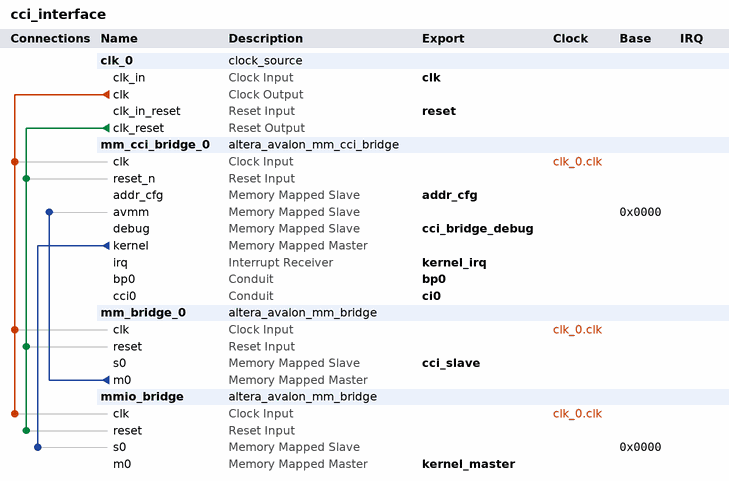
[diagram p0: system contents]
# Platform Designer (Qsys) system cci_interface, Arria 10 10AX115N3F40E2SG
# Parameters at their usual value, and those the tool derives, are not listed.
package require -exact qsys 1.0
create_system cci_interface
set_project_property DEVICE_FAMILY {Arria 10}
set_project_property DEVICE 10AX115N3F40E2SG

add_component clk_0 ip/cci_interface/cci_interface_clk_0.ip clock_source clk_0 
load_component clk_0
set_component_parameter_value clockFrequency 50000000
save_component

add_component mm_cci_bridge_0 ip/cci_interface/cci_interface_mm_cci_bridge_0.ip altera_avalon_mm_cci_bridge mm_cci_bridge_0 13.1
load_component mm_cci_bridge_0
save_component

add_component mm_bridge_0 ip/cci_interface/cci_interface_mm_bridge_0.ip altera_avalon_mm_bridge mm_bridge_0 17.0
load_component mm_bridge_0
set_component_parameter_value DATA_WIDTH 512
set_component_parameter_value ADDRESS_WIDTH 64
set_component_parameter_value USE_AUTO_ADDRESS_WIDTH 0
set_component_parameter_value ADDRESS_UNITS SYMBOLS
set_component_parameter_value MAX_BURST_SIZE 4
set_component_parameter_value MAX_PENDING_RESPONSES 64
save_component

add_component mmio_bridge ip/cci_interface/cci_interface_mmio_bridge.ip altera_avalon_mm_bridge mmio_bridge 17.0
load_component mmio_bridge
set_component_parameter_value DATA_WIDTH 64
set_component_parameter_value ADDRESS_WIDTH 18
set_component_parameter_value USE_AUTO_ADDRESS_WIDTH 0
set_component_parameter_value ADDRESS_UNITS SYMBOLS
set_component_parameter_value MAX_PENDING_RESPONSES 1024
save_component

# connections
add_connection clk_0.clk mm_bridge_0.clk clock
add_connection clk_0.clk mm_cci_bridge_0.clk clock
add_connection clk_0.clk mmio_bridge.clk clock
add_connection clk_0.clk_reset mm_bridge_0.reset reset
add_connection clk_0.clk_reset mm_cci_bridge_0.reset_n reset
add_connection clk_0.clk_reset mmio_bridge.reset reset
add_connection mm_bridge_0.m0 mm_cci_bridge_0.avmm avalon
set_connection_parameter_value mm_bridge_0.m0/mm_cci_bridge_0.avmm baseAddress 0x0000
add_connection mm_cci_bridge_0.kernel mmio_bridge.s0 avalon
set_connection_parameter_value mm_cci_bridge_0.kernel/mmio_bridge.s0 baseAddress 0x0000

# exported interfaces
add_interface addr_cfg avalon slave
set_interface_property addr_cfg EXPORT_OF mm_cci_bridge_0.addr_cfg
add_interface bp0 conduit end
set_interface_property bp0 EXPORT_OF mm_cci_bridge_0.bp0
add_interface cci_bridge_debug avalon slave
set_interface_property cci_bridge_debug EXPORT_OF mm_cci_bridge_0.debug
add_interface cci_slave avalon slave
set_interface_property cci_slave EXPORT_OF mm_bridge_0.s0
add_interface ci0 conduit end
set_interface_property ci0 EXPORT_OF mm_cci_bridge_0.cci0
add_interface clk clock sink
set_interface_property clk EXPORT_OF clk_0.clk_in
add_interface kernel_irq interrupt receiver
set_interface_property kernel_irq EXPORT_OF mm_cci_bridge_0.irq
add_interface kernel_master avalon master
set_interface_property kernel_master EXPORT_OF mmio_bridge.m0
add_interface reset reset sink
set_interface_property reset EXPORT_OF clk_0.clk_in_reset

set_interconnect_requirement {$system} qsys_mm.clockCrossingAdapter HANDSHAKE
set_interconnect_requirement {$system} qsys_mm.insertDefaultSlave false
set_interconnect_requirement {$system} qsys_mm.maxAdditionalLatency 1

save_system cci_interface.qsys
